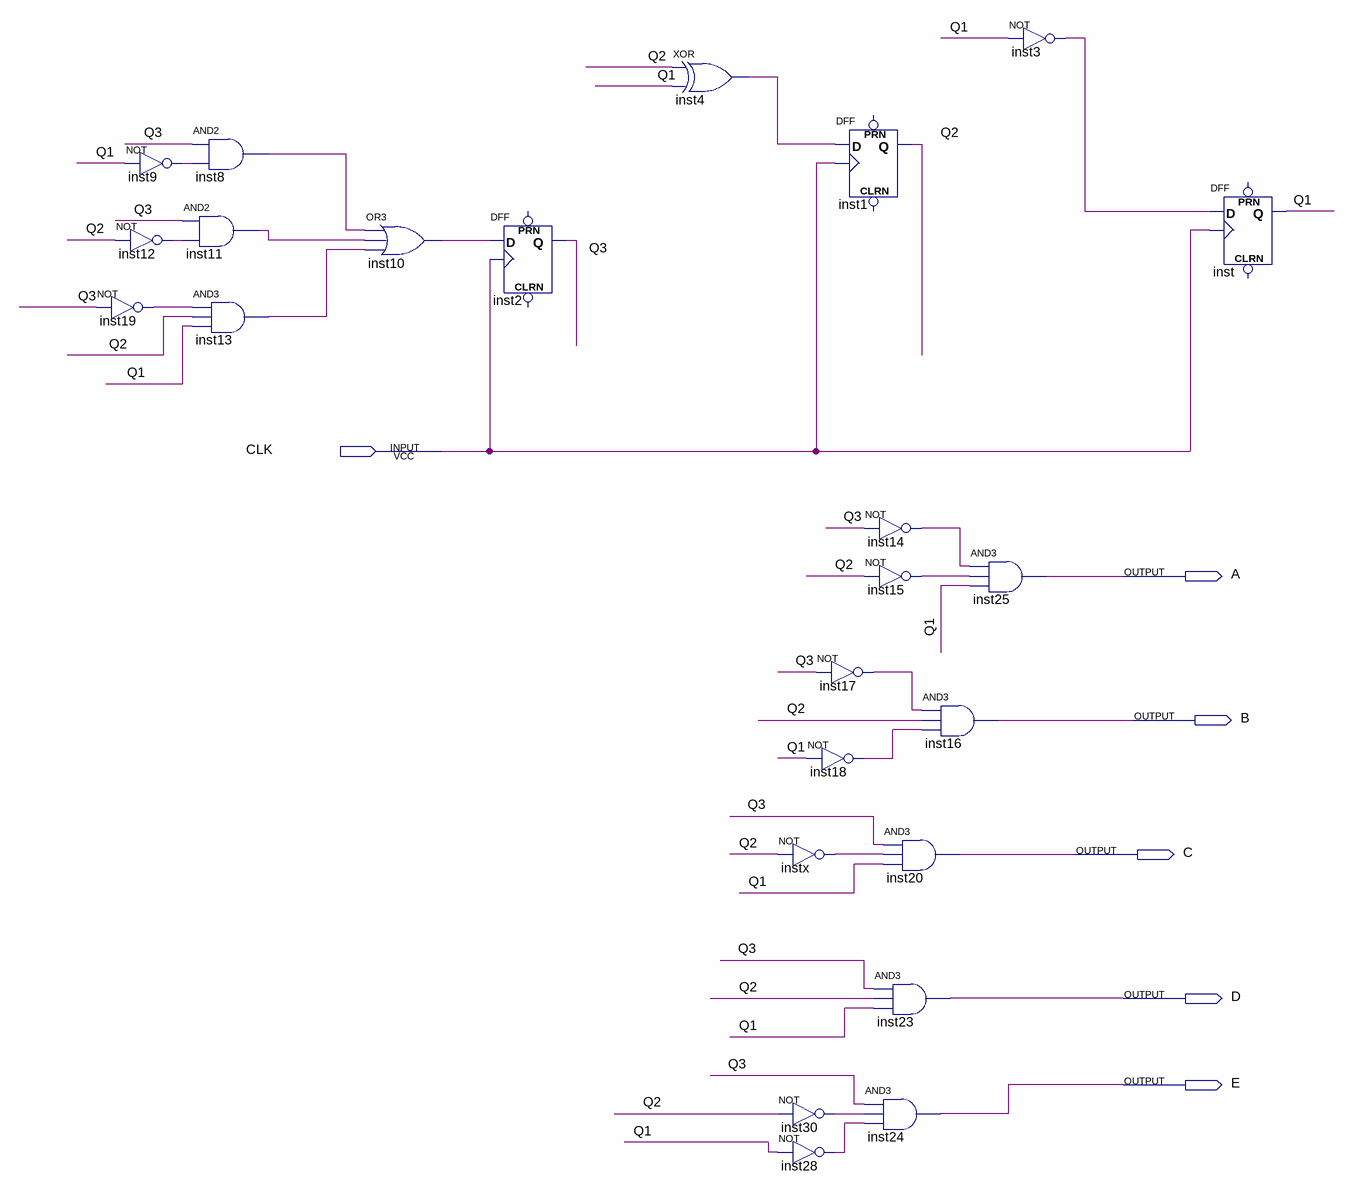
[diagram p0: schematic sheet]
// Quartus schematic GCM.bdf as structural Verilog: 24 symbols, 6 pins
module GCM (
  input  CLK,
  output A,
  output B,
  output C,
  output D,
  output E
);

  wire inst3_out, inst4_out, inst8_out, inst9_out, inst10_out, inst11_out, inst12_out, inst13_out,
       inst14_out, inst15_out, inst17_out, inst18_out, inst19_out, inst28_out, inst30_out, instx_out, Q1, Q2,
       Q3;

  not inst9 (inst9_out, Q1);
  not inst12 (inst12_out, Q2);
  not inst19 (inst19_out, Q3);
  and inst8 (inst8_out, Q3, inst9_out);
  and inst11 (inst11_out, Q3, inst12_out);
  and inst13 (inst13_out, inst19_out, Q2, Q1);
  or inst10 (inst10_out, inst8_out, inst11_out, inst13_out);
  DFF inst2 (.CLK(CLK), .D(inst10_out), .Q(Q3));  // open: CLRN, PRN
  xor inst4 (inst4_out, Q2, Q1);
  DFF inst1 (.CLK(CLK), .D(inst4_out), .Q(Q2));  // open: CLRN, PRN
  not inst17 (inst17_out, Q3);
  not inst18 (inst18_out, Q1);
  not instx (instx_out, Q2);
  not inst30 (inst30_out, Q2);
  not inst28 (inst28_out, Q1);
  not inst14 (inst14_out, Q3);
  not inst15 (inst15_out, Q2);
  and inst16 (B, inst17_out, Q2, inst18_out);
  and inst20 (C, Q3, instx_out, Q1);
  and inst23 (D, Q3, Q2, Q1);
  and inst24 (E, Q3, inst30_out, inst28_out);
  and inst25 (A, inst14_out, inst15_out, Q1);
  not inst3 (inst3_out, Q1);
  DFF inst (.CLK(CLK), .D(inst3_out), .Q(Q1));  // open: CLRN, PRN
endmodule
